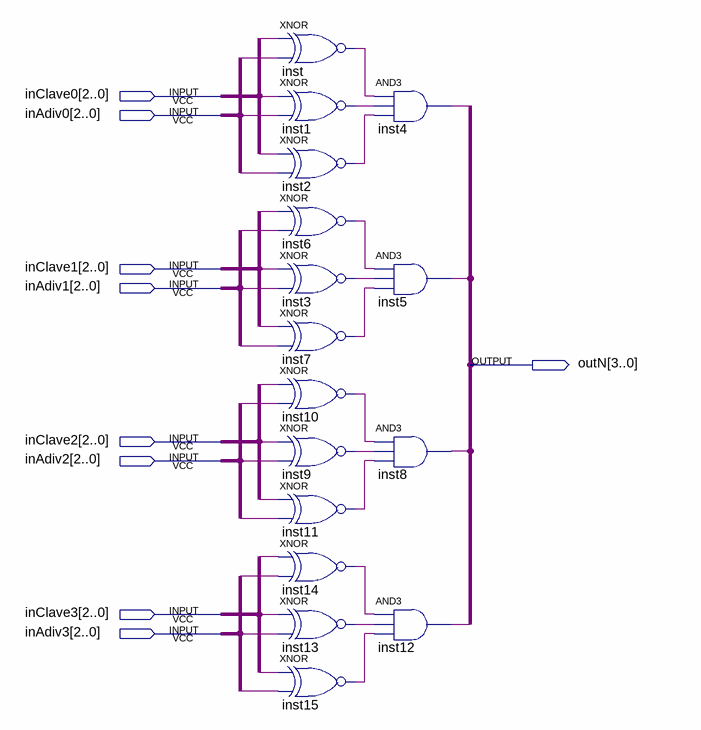
[diagram p0: schematic sheet]
// Quartus schematic COMPARA_N.bdf as structural Verilog: 16 symbols, 9 pins
module COMPARA_N (
  input  [2:0] inClave0,
  input  [2:0] inAdiv0,
  input  [2:0] inClave1,
  input  [2:0] inAdiv1,
  input  [2:0] inClave2,
  input  [2:0] inAdiv2,
  input  [2:0] inClave3,
  input  [2:0] inAdiv3,
  output [3:0] outN
);

  wire inst1_out, inst2_out, inst3_out, inst6_out, inst7_out, inst9_out, inst10_out, inst11_out, inst13_out,
       inst14_out, inst15_out, inst_out;

  xnor inst (inst_out, inClave0[2], inAdiv0[2]);
  xnor inst1 (inst1_out, inClave0[1], inAdiv0[1]);
  xnor inst2 (inst2_out, inClave0[0], inAdiv0[0]);
  xnor inst6 (inst6_out, inClave1[2], inAdiv1[2]);
  xnor inst3 (inst3_out, inClave1[1], inAdiv1[1]);
  xnor inst7 (inst7_out, inClave1[0], inAdiv1[0]);
  xnor inst10 (inst10_out, inClave2[2], inAdiv2[2]);
  xnor inst9 (inst9_out, inClave2[1], inAdiv2[1]);
  xnor inst11 (inst11_out, inClave2[0], inAdiv2[0]);
  xnor inst14 (inst14_out, inClave3[2], inAdiv3[2]);
  xnor inst13 (inst13_out, inClave3[1], inAdiv3[1]);
  xnor inst15 (inst15_out, inClave3[0], inAdiv3[0]);
  and inst4 (outN[0], inst_out, inst1_out, inst2_out);
  and inst5 (outN[1], inst6_out, inst3_out, inst7_out);
  and inst8 (outN[2], inst10_out, inst9_out, inst11_out);
  and inst12 (outN[3], inst14_out, inst13_out, inst15_out);
endmodule
